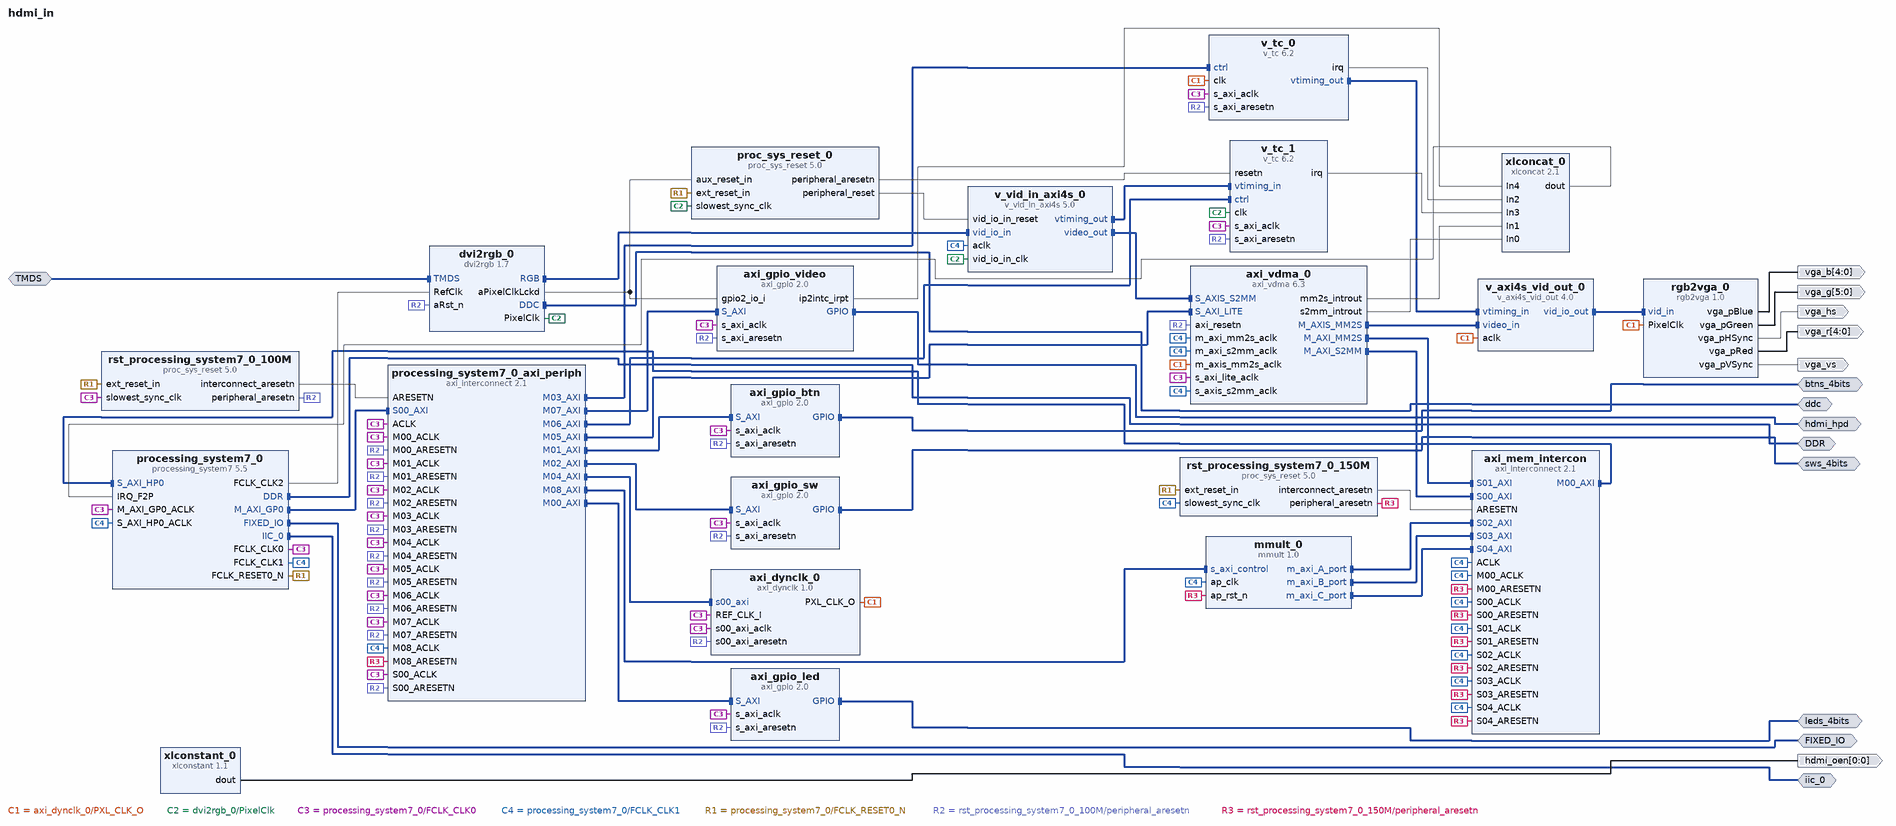
[diagram p0: block diagram of the top level]
# Vivado block design hdmi_in, xc7z010clg400-1, Vivado 2022.2
create_bd_design hdmi_in

create_bd_intf_port -mode Master -vlnv xilinx.com:interface:iic_rtl:1.0 ddc
create_bd_intf_port -mode Master -vlnv xilinx.com:interface:ddrx_rtl:1.0 DDR
create_bd_intf_port -mode Master -vlnv xilinx.com:display_processing_system7:fixedio_rtl:1.0 FIXED_IO
create_bd_intf_port -mode Slave -vlnv digilentinc.com:interface:tmds_rtl:1.0 TMDS
create_bd_intf_port -mode Master -vlnv xilinx.com:interface:gpio_rtl:1.0 btns_4bits
create_bd_intf_port -mode Master -vlnv xilinx.com:interface:gpio_rtl:1.0 hdmi_hpd
create_bd_intf_port -mode Master -vlnv xilinx.com:interface:gpio_rtl:1.0 leds_4bits
create_bd_intf_port -mode Master -vlnv xilinx.com:interface:gpio_rtl:1.0 sws_4bits
create_bd_intf_port -mode Master -vlnv xilinx.com:interface:iic_rtl:1.0 iic_0
create_bd_port -dir O -from 4 -to 0 vga_b
create_bd_port -dir O -from 5 -to 0 vga_g
create_bd_port -dir O vga_hs
create_bd_port -dir O -from 4 -to 0 vga_r
create_bd_port -dir O vga_vs
create_bd_port -dir O -from 0 -to 0 hdmi_oen

create_bd_cell -type ip -vlnv digilentinc.com:ip:axi_dynclk:1.0 axi_dynclk_0
create_bd_cell -type ip -vlnv digilentinc.com:ip:rgb2vga:1.0 rgb2vga_0
set_property -dict {CONFIG.VID_IN_DATA_WIDTH 24} [get_bd_cells rgb2vga_0]
create_bd_cell -type ip -vlnv digilentinc.com:ip:dvi2rgb:1.7 dvi2rgb_0
set_property -dict [list \
  CONFIG.kAddBUFG false \
  CONFIG.kClkRange 2 \
  CONFIG.kEdidFileName 720p_edid.data \
  CONFIG.kRstActiveHigh false \
] [get_bd_cells dvi2rgb_0]
create_bd_cell -type ip -vlnv xilinx.com:ip:axi_gpio:2.0 axi_gpio_btn
set_property -dict {CONFIG.GPIO_BOARD_INTERFACE btns_4bits CONFIG.USE_BOARD_FLOW true} [get_bd_cells axi_gpio_btn]
create_bd_cell -type ip -vlnv xilinx.com:ip:axi_gpio:2.0 axi_gpio_led
set_property -dict {CONFIG.GPIO_BOARD_INTERFACE leds_4bits CONFIG.USE_BOARD_FLOW true} [get_bd_cells axi_gpio_led]
create_bd_cell -type ip -vlnv xilinx.com:ip:axi_gpio:2.0 axi_gpio_sw
set_property -dict {CONFIG.GPIO_BOARD_INTERFACE sws_4bits CONFIG.USE_BOARD_FLOW true} [get_bd_cells axi_gpio_sw]
create_bd_cell -type ip -vlnv xilinx.com:ip:axi_gpio:2.0 axi_gpio_video
set_property -dict [list \
  CONFIG.C_ALL_INPUTS_2 1 \
  CONFIG.C_ALL_OUTPUTS 1 \
  CONFIG.C_GPIO2_WIDTH 1 \
  CONFIG.C_GPIO_WIDTH 1 \
  CONFIG.C_INTERRUPT_PRESENT 1 \
  CONFIG.C_IS_DUAL 1 \
] [get_bd_cells axi_gpio_video]
create_bd_cell -type ip -vlnv xilinx.com:ip:axi_interconnect:2.1 axi_mem_intercon
set_property -dict [list \
  CONFIG.M00_HAS_DATA_FIFO 2 \
  CONFIG.M00_HAS_REGSLICE 4 \
  CONFIG.NUM_MI 1 \
  CONFIG.NUM_SI 5 \
  CONFIG.S00_HAS_DATA_FIFO 2 \
  CONFIG.S00_HAS_REGSLICE 4 \
  CONFIG.S01_HAS_DATA_FIFO 2 \
  CONFIG.S01_HAS_REGSLICE 4 \
  CONFIG.STRATEGY 0 \
  CONFIG.SYNCHRONIZATION_STAGES 2 \
] [get_bd_cells axi_mem_intercon]
create_bd_cell -type ip -vlnv xilinx.com:ip:axi_vdma:6.3 axi_vdma_0
set_property -dict [list \
  CONFIG.c_include_mm2s_dre 0 \
  CONFIG.c_include_s2mm_dre 0 \
  CONFIG.c_m_axi_mm2s_data_width 32 \
  CONFIG.c_m_axis_mm2s_tdata_width 24 \
  CONFIG.c_mm2s_genlock_mode 0 \
  CONFIG.c_mm2s_linebuffer_depth 4096 \
  CONFIG.c_mm2s_max_burst_length 32 \
  CONFIG.c_num_fstores 3 \
  CONFIG.c_s2mm_genlock_mode 0 \
  CONFIG.c_s2mm_linebuffer_depth 4096 \
  CONFIG.c_s2mm_max_burst_length 32 \
  CONFIG.c_use_s2mm_fsync 2 \
] [get_bd_cells axi_vdma_0]
create_bd_cell -type ip -vlnv xilinx.com:ip:proc_sys_reset:5.0 proc_sys_reset_0
set_property -dict {CONFIG.C_AUX_RESET_HIGH 0 CONFIG.C_EXT_RST_WIDTH 4} [get_bd_cells proc_sys_reset_0]
create_bd_cell -type ip -vlnv xilinx.com:ip:processing_system7:5.5 processing_system7_0
set_property -dict [list \
  CONFIG.PCW_APU_PERIPHERAL_FREQMHZ 650 \
  CONFIG.PCW_CRYSTAL_PERIPHERAL_FREQMHZ 50.000000 \
  CONFIG.PCW_ENET0_ENET0_IO {MIO 16 .. 27} \
  CONFIG.PCW_ENET0_GRP_MDIO_ENABLE 1 \
  CONFIG.PCW_ENET0_GRP_MDIO_IO {MIO 52 .. 53} \
  CONFIG.PCW_ENET0_PERIPHERAL_ENABLE 1 \
  CONFIG.PCW_ENET0_RESET_ENABLE 0 \
  CONFIG.PCW_ENET_RESET_ENABLE 1 \
  CONFIG.PCW_ENET_RESET_SELECT {Share reset pin} \
  CONFIG.PCW_EN_CLK1_PORT 1 \
  CONFIG.PCW_EN_CLK2_PORT 1 \
  CONFIG.PCW_FCLK_CLK1_BUF TRUE \
  CONFIG.PCW_FCLK_CLK2_BUF TRUE \
  CONFIG.PCW_FPGA0_PERIPHERAL_FREQMHZ 100 \
  CONFIG.PCW_FPGA1_PERIPHERAL_FREQMHZ 140 \
  CONFIG.PCW_FPGA2_PERIPHERAL_FREQMHZ 200 \
  CONFIG.PCW_FPGA_FCLK1_ENABLE 1 \
  CONFIG.PCW_FPGA_FCLK2_ENABLE 1 \
  CONFIG.PCW_GP0_EN_MODIFIABLE_TXN 0 \
  CONFIG.PCW_GP1_EN_MODIFIABLE_TXN 0 \
  CONFIG.PCW_GPIO_MIO_GPIO_ENABLE 1 \
  CONFIG.PCW_GPIO_MIO_GPIO_IO MIO \
  CONFIG.PCW_I2C0_I2C0_IO EMIO \
  CONFIG.PCW_I2C0_PERIPHERAL_ENABLE 1 \
  CONFIG.PCW_I2C_PERIPHERAL_FREQMHZ 108.333336 \
  CONFIG.PCW_I2C_RESET_ENABLE 1 \
  CONFIG.PCW_I2C_RESET_SELECT {Share reset pin} \
  CONFIG.PCW_IRQ_F2P_INTR 1 \
  CONFIG.PCW_PERIPHERAL_BOARD_PRESET part0 \
  CONFIG.PCW_PRESET_BANK1_VOLTAGE {LVCMOS 1.8V} \
  CONFIG.PCW_QSPI_GRP_FBCLK_ENABLE 1 \
  CONFIG.PCW_QSPI_GRP_FBCLK_IO {MIO 8} \
  CONFIG.PCW_QSPI_GRP_SINGLE_SS_ENABLE 1 \
  CONFIG.PCW_QSPI_GRP_SINGLE_SS_IO {MIO 1 .. 6} \
  CONFIG.PCW_QSPI_PERIPHERAL_ENABLE 1 \
  CONFIG.PCW_QSPI_QSPI_IO {MIO 1 .. 6} \
  CONFIG.PCW_SD0_GRP_CD_ENABLE 1 \
  CONFIG.PCW_SD0_GRP_CD_IO {MIO 47} \
  CONFIG.PCW_SD0_GRP_WP_ENABLE 1 \
  CONFIG.PCW_SD0_GRP_WP_IO EMIO \
  CONFIG.PCW_SD0_PERIPHERAL_ENABLE 1 \
  CONFIG.PCW_SD0_SD0_IO {MIO 40 .. 45} \
  CONFIG.PCW_SDIO_PERIPHERAL_FREQMHZ 50 \
  CONFIG.PCW_SINGLE_QSPI_DATA_MODE x4 \
  CONFIG.PCW_TTC0_PERIPHERAL_ENABLE 1 \
  CONFIG.PCW_TTC0_TTC0_IO EMIO \
  CONFIG.PCW_UART1_PERIPHERAL_ENABLE 1 \
  CONFIG.PCW_UART1_UART1_IO {MIO 48 .. 49} \
  CONFIG.PCW_UART_PERIPHERAL_FREQMHZ 100 \
  CONFIG.PCW_UIPARAM_DDR_FREQ_MHZ 525 \
  CONFIG.PCW_UIPARAM_DDR_PARTNO {MT41K128M16 JT-125} \
  CONFIG.PCW_USB0_PERIPHERAL_ENABLE 1 \
  CONFIG.PCW_USB0_RESET_ENABLE 1 \
  CONFIG.PCW_USB0_RESET_IO {MIO 46} \
  CONFIG.PCW_USB0_USB0_IO {MIO 28 .. 39} \
  CONFIG.PCW_USB_RESET_ENABLE 1 \
  CONFIG.PCW_USB_RESET_SELECT {Share reset pin} \
  CONFIG.PCW_USE_FABRIC_INTERRUPT 1 \
  CONFIG.PCW_USE_S_AXI_HP0 1 \
  CONFIG.preset Default \
] [get_bd_cells processing_system7_0]
# 509 more settings of processing_system7_0 are not shown: defaults, MIO pin electricals, DDR timing, and values the tool derives
create_bd_cell -type ip -vlnv xilinx.com:ip:axi_interconnect:2.1 processing_system7_0_axi_periph
set_property -dict {CONFIG.NUM_MI 9 CONFIG.SYNCHRONIZATION_STAGES 2} [get_bd_cells processing_system7_0_axi_periph]
create_bd_cell -type ip -vlnv xilinx.com:ip:proc_sys_reset:5.0 rst_processing_system7_0_100M
create_bd_cell -type ip -vlnv xilinx.com:ip:proc_sys_reset:5.0 rst_processing_system7_0_150M
create_bd_cell -type ip -vlnv xilinx.com:ip:v_axi4s_vid_out:4.0 v_axi4s_vid_out_0
set_property -dict [list \
  CONFIG.C_ADDR_WIDTH 5 \
  CONFIG.C_HAS_ASYNC_CLK 0 \
  CONFIG.C_S_AXIS_VIDEO_DATA_WIDTH 8 \
  CONFIG.C_S_AXIS_VIDEO_FORMAT 2 \
  CONFIG.C_VTG_MASTER_SLAVE 1 \
] [get_bd_cells v_axi4s_vid_out_0]
create_bd_cell -type ip -vlnv xilinx.com:ip:v_tc:6.2 v_tc_0
set_property -dict {CONFIG.enable_detection false} [get_bd_cells v_tc_0]
create_bd_cell -type ip -vlnv xilinx.com:ip:v_tc:6.2 v_tc_1
set_property -dict [list \
  CONFIG.HAS_INTC_IF true \
  CONFIG.VIDEO_MODE 720p \
  CONFIG.enable_generation false \
  CONFIG.horizontal_blank_detection false \
  CONFIG.max_lines_per_frame 2048 \
  CONFIG.vertical_blank_detection false \
] [get_bd_cells v_tc_1]
create_bd_cell -type ip -vlnv xilinx.com:ip:v_vid_in_axi4s:5.0 v_vid_in_axi4s_0
set_property -dict {CONFIG.C_ADDR_WIDTH 12 CONFIG.C_HAS_ASYNC_CLK 1} [get_bd_cells v_vid_in_axi4s_0]
create_bd_cell -type ip -vlnv xilinx.com:ip:xlconcat:2.1 xlconcat_0
set_property -dict {CONFIG.NUM_PORTS 5 CONFIG.dout_width 5} [get_bd_cells xlconcat_0]
create_bd_cell -type ip -vlnv xilinx.com:ip:xlconstant:1.1 xlconstant_0
set_property -dict {CONFIG.CONST_VAL 0} [get_bd_cells xlconstant_0]
create_bd_cell -type ip -vlnv xilinx.com:hls:mmult:1.0 mmult_0

# ---- connections ----

connect_bd_intf_net [get_bd_intf_ports TMDS] [get_bd_intf_pins dvi2rgb_0/TMDS]
connect_bd_intf_net -intf_net axi_gpio_0_GPIO [get_bd_intf_ports btns_4bits] [get_bd_intf_pins axi_gpio_btn/GPIO]
connect_bd_intf_net -intf_net axi_gpio_0_GPIO1 [get_bd_intf_ports sws_4bits] [get_bd_intf_pins axi_gpio_sw/GPIO]
connect_bd_intf_net -intf_net axi_gpio_0_GPIO2 [get_bd_intf_ports hdmi_hpd] [get_bd_intf_pins axi_gpio_video/GPIO]
connect_bd_intf_net [get_bd_intf_ports leds_4bits] [get_bd_intf_pins axi_gpio_led/GPIO]
connect_bd_intf_net [get_bd_intf_pins axi_mem_intercon/M00_AXI] [get_bd_intf_pins processing_system7_0/S_AXI_HP0]
connect_bd_intf_net [get_bd_intf_pins axi_vdma_0/M_AXIS_MM2S] [get_bd_intf_pins v_axi4s_vid_out_0/video_in]
connect_bd_intf_net [get_bd_intf_pins axi_mem_intercon/S01_AXI] [get_bd_intf_pins axi_vdma_0/M_AXI_MM2S]
connect_bd_intf_net [get_bd_intf_pins axi_mem_intercon/S00_AXI] [get_bd_intf_pins axi_vdma_0/M_AXI_S2MM]
connect_bd_intf_net [get_bd_intf_ports ddc] [get_bd_intf_pins dvi2rgb_0/DDC]
connect_bd_intf_net [get_bd_intf_pins dvi2rgb_0/RGB] [get_bd_intf_pins v_vid_in_axi4s_0/vid_io_in]
connect_bd_intf_net [get_bd_intf_pins mmult_0/m_axi_A_port] [get_bd_intf_pins axi_mem_intercon/S02_AXI]
connect_bd_intf_net [get_bd_intf_pins mmult_0/m_axi_B_port] [get_bd_intf_pins axi_mem_intercon/S03_AXI]
connect_bd_intf_net [get_bd_intf_pins mmult_0/m_axi_C_port] [get_bd_intf_pins axi_mem_intercon/S04_AXI]
connect_bd_intf_net [get_bd_intf_ports DDR] [get_bd_intf_pins processing_system7_0/DDR]
connect_bd_intf_net [get_bd_intf_ports FIXED_IO] [get_bd_intf_pins processing_system7_0/FIXED_IO]
connect_bd_intf_net [get_bd_intf_ports iic_0] [get_bd_intf_pins processing_system7_0/IIC_0]
connect_bd_intf_net [get_bd_intf_pins processing_system7_0/M_AXI_GP0] [get_bd_intf_pins processing_system7_0_axi_periph/S00_AXI]
connect_bd_intf_net [get_bd_intf_pins axi_gpio_led/S_AXI] [get_bd_intf_pins processing_system7_0_axi_periph/M00_AXI]
connect_bd_intf_net [get_bd_intf_pins axi_gpio_btn/S_AXI] [get_bd_intf_pins processing_system7_0_axi_periph/M01_AXI]
connect_bd_intf_net [get_bd_intf_pins axi_gpio_sw/S_AXI] [get_bd_intf_pins processing_system7_0_axi_periph/M02_AXI]
connect_bd_intf_net [get_bd_intf_pins processing_system7_0_axi_periph/M03_AXI] [get_bd_intf_pins v_tc_0/ctrl]
connect_bd_intf_net [get_bd_intf_pins axi_dynclk_0/s00_axi] [get_bd_intf_pins processing_system7_0_axi_periph/M04_AXI]
connect_bd_intf_net [get_bd_intf_pins axi_vdma_0/S_AXI_LITE] [get_bd_intf_pins processing_system7_0_axi_periph/M05_AXI]
connect_bd_intf_net [get_bd_intf_pins processing_system7_0_axi_periph/M06_AXI] [get_bd_intf_pins v_tc_1/ctrl]
connect_bd_intf_net [get_bd_intf_pins axi_gpio_video/S_AXI] [get_bd_intf_pins processing_system7_0_axi_periph/M07_AXI]
connect_bd_intf_net [get_bd_intf_pins processing_system7_0_axi_periph/M08_AXI] [get_bd_intf_pins mmult_0/s_axi_control]
connect_bd_intf_net [get_bd_intf_pins rgb2vga_0/vid_in] [get_bd_intf_pins v_axi4s_vid_out_0/vid_io_out]
connect_bd_intf_net [get_bd_intf_pins v_axi4s_vid_out_0/vtiming_in] [get_bd_intf_pins v_tc_0/vtiming_out]
connect_bd_intf_net [get_bd_intf_pins axi_vdma_0/S_AXIS_S2MM] [get_bd_intf_pins v_vid_in_axi4s_0/video_out]
connect_bd_intf_net [get_bd_intf_pins v_tc_1/vtiming_in] [get_bd_intf_pins v_vid_in_axi4s_0/vtiming_out]
connect_bd_net [get_bd_pins axi_dynclk_0/PXL_CLK_O] \
  [get_bd_pins rgb2vga_0/PixelClk] [get_bd_pins axi_vdma_0/m_axis_mm2s_aclk] [get_bd_pins v_axi4s_vid_out_0/aclk] \
  [get_bd_pins v_tc_0/clk]
connect_bd_net [get_bd_pins axi_gpio_video/ip2intc_irpt] [get_bd_pins xlconcat_0/In4]
connect_bd_net [get_bd_pins axi_vdma_0/mm2s_introut] [get_bd_pins xlconcat_0/In1]
connect_bd_net [get_bd_pins axi_vdma_0/s2mm_introut] [get_bd_pins xlconcat_0/In0]
connect_bd_net [get_bd_pins dvi2rgb_0/PixelClk] \
  [get_bd_pins proc_sys_reset_0/slowest_sync_clk] [get_bd_pins v_tc_1/clk] [get_bd_pins v_vid_in_axi4s_0/vid_io_in_clk]
connect_bd_net [get_bd_pins dvi2rgb_0/aPixelClkLckd] [get_bd_pins axi_gpio_video/gpio2_io_i] [get_bd_pins proc_sys_reset_0/aux_reset_in]
connect_bd_net [get_bd_pins proc_sys_reset_0/peripheral_aresetn] [get_bd_pins v_tc_1/resetn]
connect_bd_net [get_bd_pins proc_sys_reset_0/peripheral_reset] [get_bd_pins v_vid_in_axi4s_0/vid_io_in_reset]
connect_bd_net [get_bd_pins processing_system7_0/FCLK_CLK0] \
  [get_bd_pins axi_dynclk_0/REF_CLK_I] [get_bd_pins axi_dynclk_0/s00_axi_aclk] [get_bd_pins axi_gpio_btn/s_axi_aclk] \
  [get_bd_pins axi_gpio_led/s_axi_aclk] [get_bd_pins axi_gpio_sw/s_axi_aclk] [get_bd_pins axi_gpio_video/s_axi_aclk] \
  [get_bd_pins axi_vdma_0/s_axi_lite_aclk] [get_bd_pins processing_system7_0/M_AXI_GP0_ACLK] \
  [get_bd_pins processing_system7_0_axi_periph/ACLK] [get_bd_pins processing_system7_0_axi_periph/S00_ACLK] \
  [get_bd_pins processing_system7_0_axi_periph/M00_ACLK] [get_bd_pins processing_system7_0_axi_periph/M01_ACLK] \
  [get_bd_pins processing_system7_0_axi_periph/M02_ACLK] [get_bd_pins processing_system7_0_axi_periph/M03_ACLK] \
  [get_bd_pins processing_system7_0_axi_periph/M04_ACLK] [get_bd_pins processing_system7_0_axi_periph/M05_ACLK] \
  [get_bd_pins processing_system7_0_axi_periph/M06_ACLK] [get_bd_pins processing_system7_0_axi_periph/M07_ACLK] \
  [get_bd_pins rst_processing_system7_0_100M/slowest_sync_clk] [get_bd_pins v_tc_0/s_axi_aclk] \
  [get_bd_pins v_tc_1/s_axi_aclk]
connect_bd_net [get_bd_pins processing_system7_0/FCLK_CLK1] \
  [get_bd_pins axi_mem_intercon/ACLK] [get_bd_pins axi_mem_intercon/S00_ACLK] [get_bd_pins axi_mem_intercon/S01_ACLK] \
  [get_bd_pins axi_mem_intercon/M00_ACLK] [get_bd_pins axi_vdma_0/m_axi_mm2s_aclk] [get_bd_pins axi_vdma_0/m_axi_s2mm_aclk] \
  [get_bd_pins axi_vdma_0/s_axis_s2mm_aclk] [get_bd_pins processing_system7_0/S_AXI_HP0_ACLK] \
  [get_bd_pins rst_processing_system7_0_150M/slowest_sync_clk] [get_bd_pins v_vid_in_axi4s_0/aclk] \
  [get_bd_pins mmult_0/ap_clk] [get_bd_pins axi_mem_intercon/S02_ACLK] [get_bd_pins axi_mem_intercon/S03_ACLK] \
  [get_bd_pins axi_mem_intercon/S04_ACLK] [get_bd_pins processing_system7_0_axi_periph/M08_ACLK]
connect_bd_net [get_bd_pins processing_system7_0/FCLK_CLK2] [get_bd_pins dvi2rgb_0/RefClk]
connect_bd_net [get_bd_pins processing_system7_0/FCLK_RESET0_N] \
  [get_bd_pins proc_sys_reset_0/ext_reset_in] [get_bd_pins rst_processing_system7_0_100M/ext_reset_in] \
  [get_bd_pins rst_processing_system7_0_150M/ext_reset_in]
connect_bd_net [get_bd_pins rgb2vga_0/vga_pBlue] [get_bd_ports vga_b]
connect_bd_net [get_bd_pins rgb2vga_0/vga_pGreen] [get_bd_ports vga_g]
connect_bd_net [get_bd_pins rgb2vga_0/vga_pHSync] [get_bd_ports vga_hs]
connect_bd_net [get_bd_pins rgb2vga_0/vga_pRed] [get_bd_ports vga_r]
connect_bd_net [get_bd_pins rgb2vga_0/vga_pVSync] [get_bd_ports vga_vs]
connect_bd_net [get_bd_pins rst_processing_system7_0_100M/interconnect_aresetn] [get_bd_pins processing_system7_0_axi_periph/ARESETN]
connect_bd_net [get_bd_pins rst_processing_system7_0_100M/peripheral_aresetn] \
  [get_bd_pins axi_dynclk_0/s00_axi_aresetn] [get_bd_pins dvi2rgb_0/aRst_n] [get_bd_pins axi_gpio_btn/s_axi_aresetn] \
  [get_bd_pins axi_gpio_led/s_axi_aresetn] [get_bd_pins axi_gpio_sw/s_axi_aresetn] [get_bd_pins axi_gpio_video/s_axi_aresetn] \
  [get_bd_pins axi_vdma_0/axi_resetn] [get_bd_pins processing_system7_0_axi_periph/S00_ARESETN] \
  [get_bd_pins processing_system7_0_axi_periph/M00_ARESETN] [get_bd_pins processing_system7_0_axi_periph/M01_ARESETN] \
  [get_bd_pins processing_system7_0_axi_periph/M02_ARESETN] [get_bd_pins processing_system7_0_axi_periph/M03_ARESETN] \
  [get_bd_pins processing_system7_0_axi_periph/M04_ARESETN] [get_bd_pins processing_system7_0_axi_periph/M05_ARESETN] \
  [get_bd_pins processing_system7_0_axi_periph/M06_ARESETN] [get_bd_pins processing_system7_0_axi_periph/M07_ARESETN] \
  [get_bd_pins v_tc_0/s_axi_aresetn] [get_bd_pins v_tc_1/s_axi_aresetn]
connect_bd_net [get_bd_pins rst_processing_system7_0_150M/interconnect_aresetn] [get_bd_pins axi_mem_intercon/ARESETN]
connect_bd_net [get_bd_pins rst_processing_system7_0_150M/peripheral_aresetn] \
  [get_bd_pins axi_mem_intercon/S00_ARESETN] [get_bd_pins axi_mem_intercon/S01_ARESETN] \
  [get_bd_pins axi_mem_intercon/M00_ARESETN] [get_bd_pins mmult_0/ap_rst_n] [get_bd_pins axi_mem_intercon/S02_ARESETN] \
  [get_bd_pins axi_mem_intercon/S03_ARESETN] [get_bd_pins axi_mem_intercon/S04_ARESETN] \
  [get_bd_pins processing_system7_0_axi_periph/M08_ARESETN]
connect_bd_net [get_bd_pins v_tc_0/irq] [get_bd_pins xlconcat_0/In2]
connect_bd_net [get_bd_pins v_tc_1/irq] [get_bd_pins xlconcat_0/In3]
connect_bd_net [get_bd_pins xlconcat_0/dout] [get_bd_pins processing_system7_0/IRQ_F2P]
connect_bd_net [get_bd_pins xlconstant_0/dout] [get_bd_ports hdmi_oen]

# ---- address map ----
assign_bd_address -offset 0x00000000 -range 512M -target_address_space [get_bd_addr_spaces axi_vdma_0/Data_MM2S] [get_bd_addr_segs processing_system7_0/S_AXI_HP0/HP0_DDR_LOWOCM]
assign_bd_address -offset 0x00000000 -range 512M -target_address_space [get_bd_addr_spaces axi_vdma_0/Data_S2MM] [get_bd_addr_segs processing_system7_0/S_AXI_HP0/HP0_DDR_LOWOCM]
assign_bd_address -offset 0x0000000000000000 -range 512M -target_address_space [get_bd_addr_spaces mmult_0/Data_m_axi_A_port] [get_bd_addr_segs processing_system7_0/S_AXI_HP0/HP0_DDR_LOWOCM]
assign_bd_address -offset 0x0000000000000000 -range 512M -target_address_space [get_bd_addr_spaces mmult_0/Data_m_axi_B_port] [get_bd_addr_segs processing_system7_0/S_AXI_HP0/HP0_DDR_LOWOCM]
assign_bd_address -offset 0x0000000000000000 -range 512M -target_address_space [get_bd_addr_spaces mmult_0/Data_m_axi_C_port] [get_bd_addr_segs processing_system7_0/S_AXI_HP0/HP0_DDR_LOWOCM]
assign_bd_address -offset 0x40000000 -range 64K -target_address_space [get_bd_addr_spaces processing_system7_0/Data] [get_bd_addr_segs mmult_0/s_axi_control/Reg]
assign_bd_address -offset 0x41200000 -range 64K -target_address_space [get_bd_addr_spaces processing_system7_0/Data] [get_bd_addr_segs axi_gpio_led/S_AXI/Reg]
assign_bd_address -offset 0x41210000 -range 64K -target_address_space [get_bd_addr_spaces processing_system7_0/Data] [get_bd_addr_segs axi_gpio_btn/S_AXI/Reg]
assign_bd_address -offset 0x41220000 -range 64K -target_address_space [get_bd_addr_spaces processing_system7_0/Data] [get_bd_addr_segs axi_gpio_sw/S_AXI/Reg]
assign_bd_address -offset 0x41230000 -range 64K -target_address_space [get_bd_addr_spaces processing_system7_0/Data] [get_bd_addr_segs axi_gpio_video/S_AXI/Reg]
assign_bd_address -offset 0x43000000 -range 64K -target_address_space [get_bd_addr_spaces processing_system7_0/Data] [get_bd_addr_segs axi_vdma_0/S_AXI_LITE/Reg]
assign_bd_address -offset 0x43C00000 -range 64K -target_address_space [get_bd_addr_spaces processing_system7_0/Data] [get_bd_addr_segs v_tc_0/ctrl/Reg]
assign_bd_address -offset 0x43C10000 -range 64K -target_address_space [get_bd_addr_spaces processing_system7_0/Data] [get_bd_addr_segs axi_dynclk_0/s00_axi/reg0]
assign_bd_address -offset 0x43C20000 -range 64K -target_address_space [get_bd_addr_spaces processing_system7_0/Data] [get_bd_addr_segs v_tc_1/ctrl/Reg]

validate_bd_design
save_bd_design
